# Altium schematic sheet Régulateur USB HT BT.SchDoc: RÉGULATEUR DE TENSION USB-C HT BT
size A4; DrawnBy: ELOTMANI Nassima; Address4: 6; DocumentNumber: 6/6; Revision: V5.0 REV.A; SheetNumber: 6; SheetTotal: 6
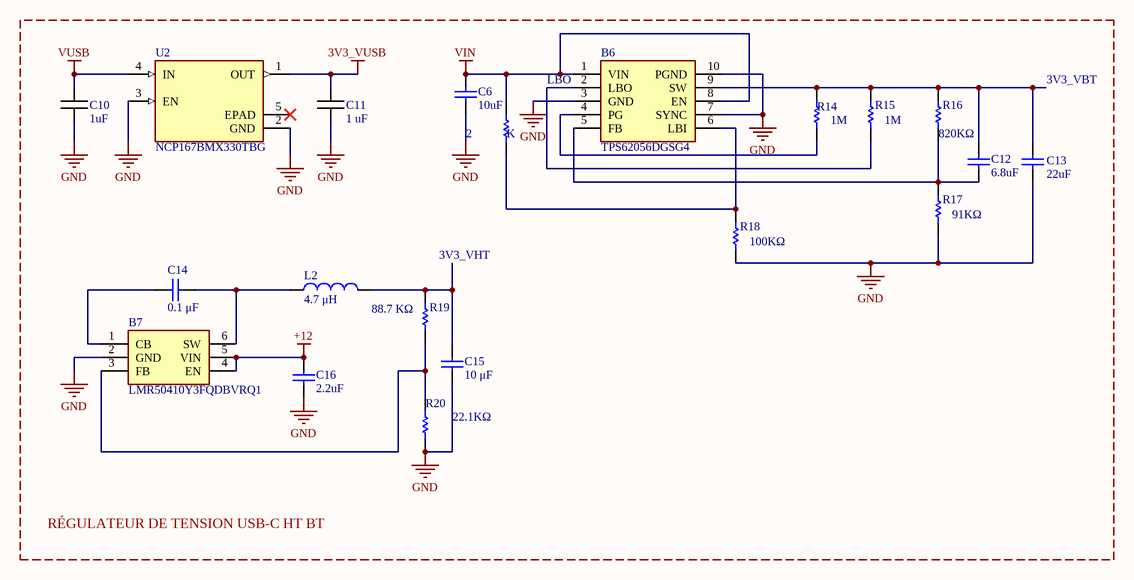
[diagram p0: Régulateur USB HT BT.SchDoc]

## Parts
2  value K  (hidden comment: R6)
B6  TPS62056DGSG4  [SOP50P490X110-10N]
B7  LMR50410Y3FQDBVRQ1  [SOT95P280X145-6N]
C6  value 10uF  (hidden comment: Comment)
C10  1uF  [CAPC1005X06N]
C11  1 uF  [CAPC1005X06N]
C12  value 6.8uF  (hidden comment: Comment)
C13  value 22uF  (hidden comment: Comment)
C14  value 0.1 μF  (hidden comment: Comment)
C15  value 10 μF  (hidden comment: Comment)
C16  value 2.2uF  (hidden comment: Comment)
L2  value 4.7 μH  (hidden comment: Comment)
R14  value 1M  (hidden comment: Comment)
R15  value 1M  (hidden comment: Comment)
R16  value 820KΩ  (hidden comment: Comment)
R17  value 91KΩ  (hidden comment: Comment)
R18  value 100KΩ  (hidden comment: Comment)
R19  value 88.7 KΩ  (hidden comment: Comment)
R20  value 22.1KΩ  (hidden comment: Comment)
U2  NCP167BMX330TBG  [NCP167BMX330TBG]

## Nets
3V3_VUSB: C11.2 U2.1(OUT)
+12: B7.4(EN) B7.5(VIN) C16.1
GND: B6.3(GND) B6.7(SYNC) B6.10(PGND) B7.2(GND) C6.2 C10.1 C11.1 C13.2 C15.2 C16.2 R17.1 R18.2 R20.2 U2.2(GND) U2.3(EN)
VIN: 2.2 B6.1(VIN) B6.8(EN) C6.1
VUSB: C10.2 U2.4(IN)
Net2_1: 2.1 B6.6(LBI) R18.1
NetB6_2: B6.2(LBO) R15.2
NetB6_4: B6.4(PG) R14.2
NetB6_5: B6.5(FB) C12.2 R16.2 R17.2
NetB6_9: B6.9(SW) C12.2 C13.2 R14.2 R15.2 R16.2
NetB7_1: B7.1(CB) C14.1
NetB7_3: B7.3(FB) R19.2 R20.1
NetB7_6: B7.6(SW) C14.2 L2.1
NetC15_2: C15.2 L2.2 R19.2

Not connected (* = marked no-connect by the designer): U2 5(EPAD)*

## Notes on the sheet
- LBO
- 3V3_VBT
- (near R19) 3V3_VHT
- RÉGULATEUR DE TENSION USB-C HT BT

## Library data of the parts
2 R14-R20 = Resistor: TC1: 0; SimulationGenericComponent: True; TC2: 0
B6 = TPS62056DGSG4: TEXAS INSTRUMENTS - TPS62056DGSG4 - Synchronous Buck (Step Down) Switching Regulator, Fixed, 2.7V-10Vin, 3.3V/0.8A out, 850kHz, VSSOP-10; Manufacturer_Name: Texas Instruments; Manufacturer_Part_Number: TPS62056DGSG4; Mouser Part Number: 595-TPS62056DGSG4
B7 = LMR50410Y3FQDBVRQ1: Régulateurs de tension de commutation Automotive qualified SIMPLE SWITCHER 4-V to 36-V, 1-A synchronous step-down converter 6-SOT-23 -40 to 150; Manufacturer_Name: Texas Instruments; Manufacturer_Part_Number: LMR50410Y3FQDBVRQ1; Mouser Part Number: 595-R50410Y3FQDBVRQ1
C6 C12-C16 = Capacitor: SimulationGenericComponent: True
C10 C11 = Capacitor
L2 = Inductor: SimulationGenericComponent: True
U2 = NCP167BMX330TBG: Régulateurs de tension LDO LDO 700 MA ULTRA-LOW NOISE 3.3V